# Altium schematic sheet SpeedRadarSchematic.SchDoc
size A; SheetNumber: 1; SheetTotal: 4
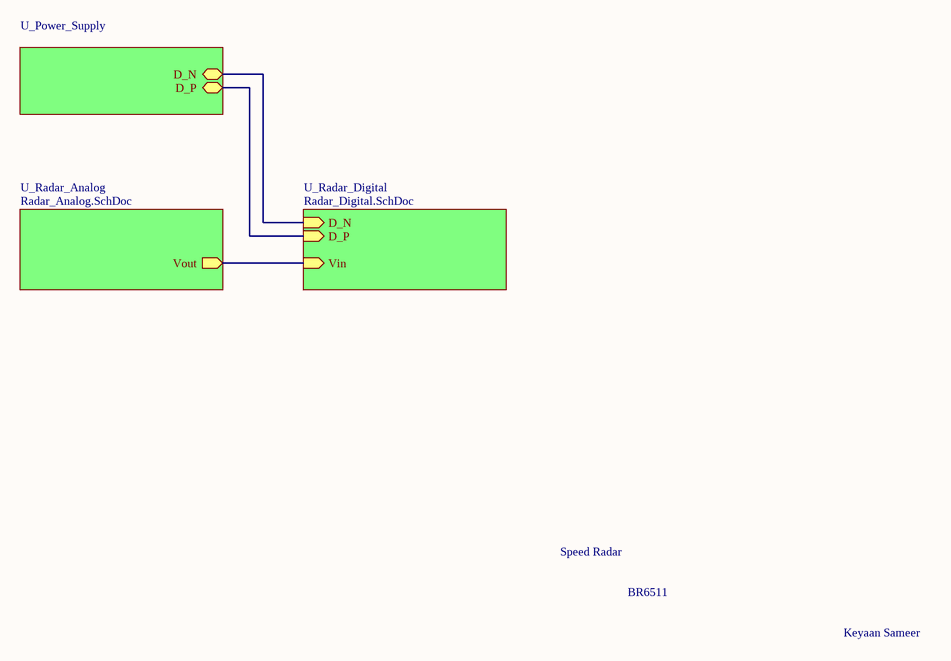
[diagram p0: SpeedRadarSchematic.SchDoc]

## Sub-sheets
U_Power_Supply = Power_Supply.SchDoc: D_N (bidir), D_P (bidir)
U_Radar_Analog = Radar_Analog.SchDoc: Vout (out)
U_Radar_Digital = Radar_Digital.SchDoc: D_N (in), D_P (in), Vin (in)

## Nets
(unnamed): sheet U_Power_Supply/D_N, sheet U_Radar_Digital/D_N
(unnamed): sheet U_Power_Supply/D_P, sheet U_Radar_Digital/D_P
(unnamed): sheet U_Radar_Digital/Vin, sheet U_Radar_Analog/Vout

## Notes on the sheet
- Speed Radar
- BR6511
- Keyaan Sameer